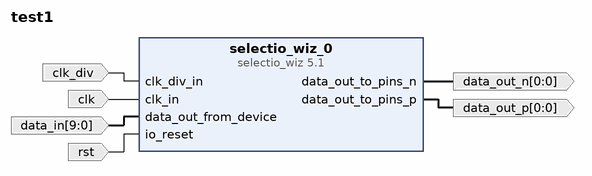
[diagram p0: block diagram of the top level]
# Vivado block design test1, xc7s15ftgb196-1, Vivado 2025.2
create_bd_design test1

create_bd_port -dir I clk_div
create_bd_port -dir I -type clk clk
create_bd_port -dir I -from 9 -to 0 -type data data_in
create_bd_port -dir O -from 0 -to 0 data_out_n
create_bd_port -dir O -from 0 -to 0 data_out_p
create_bd_port -dir I -type rst rst
set_property -dict {CONFIG.POLARITY ACTIVE_HIGH} [get_bd_ports rst]

create_bd_cell -type ip -vlnv xilinx.com:ip:selectio_wiz:5.1 selectio_wiz_0
set_property -dict [list \
  CONFIG.BUS_DIR OUTPUTS \
  CONFIG.BUS_IO_STD TMDS_33 \
  CONFIG.BUS_SIG_TYPE DIFF \
  CONFIG.CLK_FWD false \
  CONFIG.CLK_FWD_IO_STD TMDS_33 \
  CONFIG.CLK_FWD_SIG_TYPE DIFF \
  CONFIG.SELIO_ACTIVE_EDGE DDR \
  CONFIG.SELIO_BUS_IN_DELAY NONE \
  CONFIG.SELIO_CLK_BUF MMCM \
  CONFIG.SELIO_CLK_IO_STD TMDS_33 \
  CONFIG.SELIO_CLK_SIG_TYPE DIFF \
  CONFIG.SELIO_INTERFACE_TYPE NETWORKING \
  CONFIG.SERIALIZATION_FACTOR 10 \
  CONFIG.SYSTEM_DATA_WIDTH 1 \
  CONFIG.USE_SERIALIZATION true \
] [get_bd_cells selectio_wiz_0]

# ---- connections ----

connect_bd_net -net clk_div_in_0_1 [get_bd_ports clk_div] [get_bd_pins selectio_wiz_0/clk_div_in]
connect_bd_net -net clk_in_0_1 [get_bd_ports clk] [get_bd_pins selectio_wiz_0/clk_in]
connect_bd_net -net data_out_from_device_0_1 [get_bd_ports data_in] [get_bd_pins selectio_wiz_0/data_out_from_device]
connect_bd_net -net io_reset_0_1 [get_bd_ports rst] [get_bd_pins selectio_wiz_0/io_reset]
connect_bd_net [get_bd_pins selectio_wiz_0/data_out_to_pins_n] [get_bd_ports data_out_n]
connect_bd_net [get_bd_pins selectio_wiz_0/data_out_to_pins_p] [get_bd_ports data_out_p]

validate_bd_design
save_bd_design
